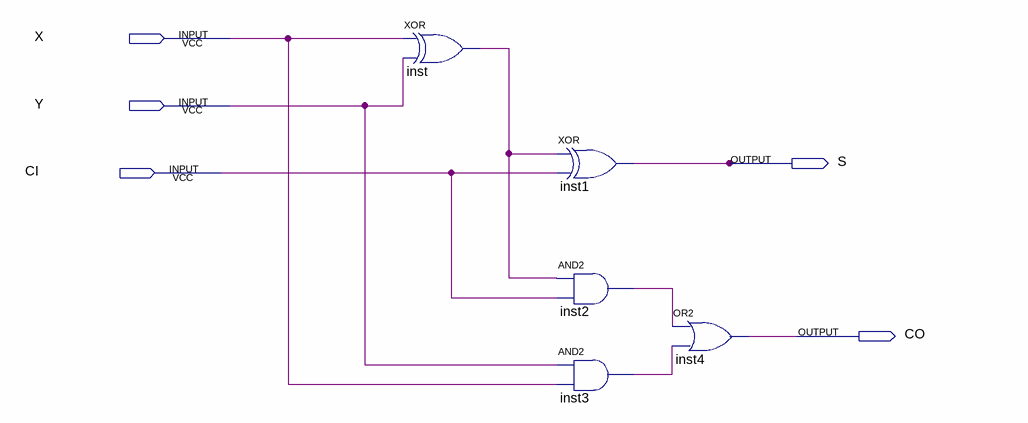
[diagram p0: schematic sheet]
// Quartus schematic full_adder.bdf as structural Verilog: 5 symbols, 5 pins
module full_adder (
  input  X,
  input  Y,
  input  CI,
  output S,
  output CO
);

  wire inst2_out, inst3_out, inst_out;

  xor inst (inst_out, X, Y);
  xor inst1 (S, inst_out, CI);
  and inst2 (inst2_out, inst_out, CI);
  and inst3 (inst3_out, Y, X);
  or inst4 (CO, inst2_out, inst3_out);
endmodule
